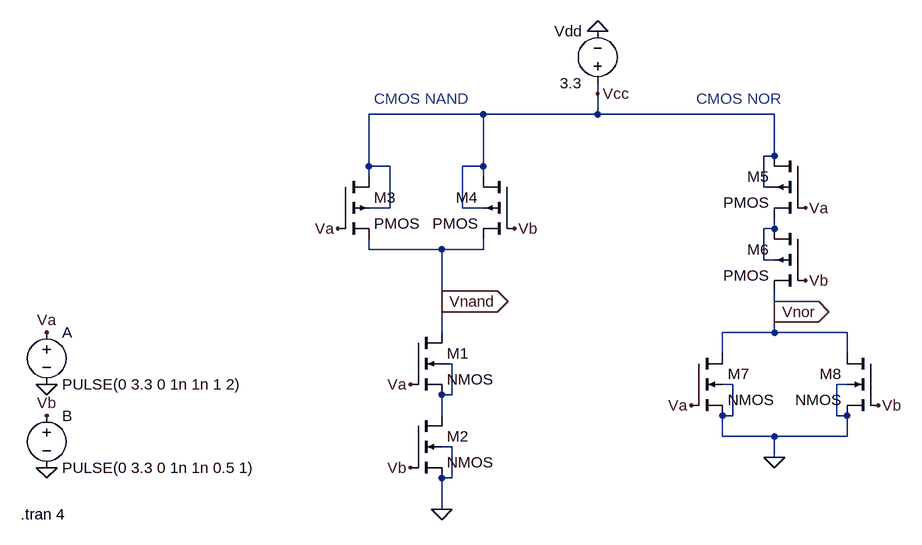
[diagram p0: schematic CMOS_Gates.asc]
CMOS_Gates.asc, the LTspice schematic file:
Version 4
SHEET 1 2308 1252
WIRE 752 -32 752 -48
WIRE 576 0 400 0
WIRE 752 0 752 -32
WIRE 752 0 576 0
WIRE 1024 0 752 0
WIRE 1024 64 1024 0
WIRE 1024 64 1008 64
WIRE 400 80 400 0
WIRE 432 80 400 80
WIRE 576 80 576 0
WIRE 576 80 544 80
WIRE 400 96 400 80
WIRE 576 96 576 80
WIRE 1008 112 1008 64
WIRE 1024 112 1008 112
WIRE 432 144 432 80
WIRE 432 144 400 144
WIRE 544 144 544 80
WIRE 576 144 544 144
WIRE 1024 176 1024 160
WIRE 1024 176 1008 176
WIRE 400 208 400 192
WIRE 512 208 400 208
WIRE 576 208 576 192
WIRE 576 208 512 208
WIRE 1008 224 1008 176
WIRE 1024 224 1008 224
WIRE 512 288 512 208
WIRE 1024 304 1024 272
WIRE 512 336 512 288
WIRE 1024 336 1024 304
WIRE 1024 336 944 336
WIRE 1136 336 1024 336
WIRE 944 368 944 336
WIRE 1136 368 1136 336
WIRE 528 384 512 384
WIRE 960 416 944 416
WIRE 1136 416 1120 416
WIRE 528 432 528 384
WIRE 528 432 512 432
WIRE 512 464 512 432
WIRE 960 464 960 416
WIRE 960 464 944 464
WIRE 1120 464 1120 416
WIRE 1136 464 1120 464
WIRE 944 496 944 464
WIRE 1024 496 944 496
WIRE 1136 496 1136 464
WIRE 1136 496 1024 496
WIRE 528 512 512 512
WIRE 1024 528 1024 496
WIRE 528 560 528 512
WIRE 528 560 512 560
WIRE 512 608 512 560
FLAG -96 416 0
FLAG -96 544 0
FLAG 752 -128 0
FLAG 512 608 0
FLAG -96 336 Va
FLAG 352 176 Va
FLAG 464 416 Va
FLAG -96 464 Vb
FLAG 464 544 Vb
FLAG 624 176 Vb
FLAG 512 288 Vnand
IOPIN 512 288 Out
FLAG 1072 144 Va
FLAG 896 448 Va
FLAG 1072 256 Vb
FLAG 1184 448 Vb
FLAG 1024 528 0
FLAG 1024 304 Vnor
IOPIN 1024 304 Out
FLAG 752 -32 Vcc
SYMBOL nmos4 464 336 R0
SYMATTR InstName M1
SYMBOL nmos4 464 464 R0
SYMATTR InstName M2
SYMBOL pmos4 352 96 R0
SYMATTR InstName M3
SYMBOL pmos4 624 96 M0
SYMATTR InstName M4
SYMBOL voltage -96 320 R0
WINDOW 123 0 0 Left 0
WINDOW 39 0 0 Left 0
SYMATTR InstName A
SYMATTR Value PULSE(0 3.3 0 1n 1n 1 2)
SYMBOL voltage -96 448 R0
SYMATTR InstName B
SYMATTR Value PULSE(0 3.3 0 1n 1n 0.5 1)
SYMBOL voltage 752 -32 R180
WINDOW 0 24 96 Left 2
WINDOW 3 24 16 Left 2
SYMATTR InstName Vdd
SYMATTR Value 3.3
SYMBOL pmos4 1072 64 M0
SYMATTR InstName M5
SYMBOL pmos4 1072 176 M0
SYMATTR InstName M6
SYMBOL nmos4 896 368 R0
SYMATTR InstName M7
SYMBOL nmos4 1184 368 M0
SYMATTR InstName M8
TEXT 408 -24 Left 2 ;CMOS NAND
TEXT -136 616 Left 2 !.tran 4
TEXT 904 -24 Left 2 ;CMOS NOR

The netlist it stands for:
* CMOS_Gates.asc
M1 Vnand Va N002 N002 NMOS
M2 N002 Vb 0 0 NMOS
M3 Vcc Va Vnand Vcc PMOS
M4 Vcc Vb Vnand Vcc PMOS
V§A Va 0 PULSE(0 3.3 0 1n 1n 1 2)
V§B Vb 0 PULSE(0 3.3 0 1n 1n 0.5 1)
Vdd Vcc 0 3.3
M5 Vcc Va N001 Vcc PMOS
M6 N001 Vb Vnor N001 PMOS
M7 Vnor Va 0 0 NMOS
M8 Vnor Vb 0 0 NMOS
.model NMOS NMOS
.model PMOS PMOS
.lib standard.mos
* CMOS NAND
.tran 4
* CMOS NOR
.backanno
.end